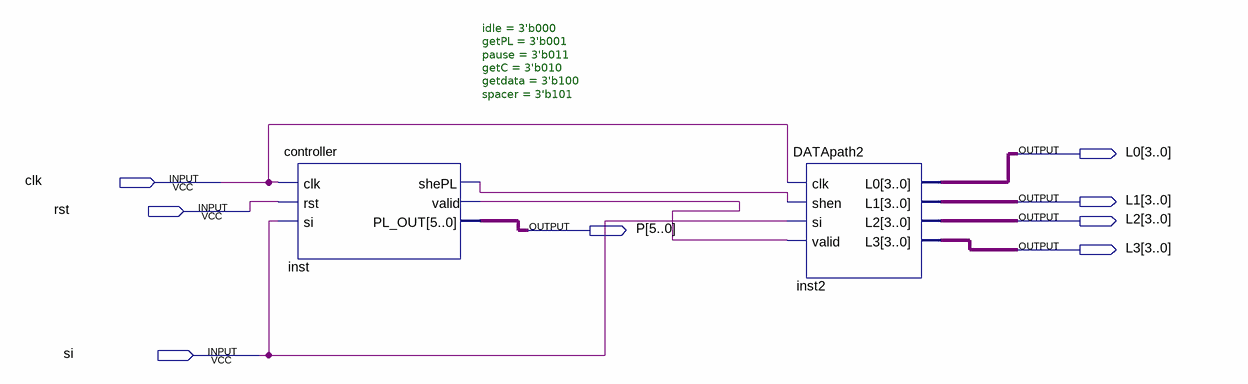
[diagram p0: schematic sheet]
// Quartus schematic CA5.bdf as structural Verilog: 2 symbols, 8 pins
module CA5 (
  input  clk,
  input  rst,
  input  si,
  output [3:0] L0,
  output [3:0] L1,
  output [3:0] L2,
  output [5:0] P,
  output [3:0] L3
);

  wire inst_shepl, inst_valid;

  controller #(.idle(3'b000), .getPL(3'b001), .pause(3'b011), .getC(3'b010), .getdata(3'b100), .spacer(3'b101)) inst (
    .clk(clk), .rst(rst), .si(si), .shePL(inst_shepl), .valid(inst_valid), .PL_OUT(P));
  DATApath2 inst2 (.clk(clk), .shen(inst_shepl), .si(si), .valid(inst_valid), .L0(L0), .L1(L1), .L2(L2), .L3(L3));
endmodule
